# EAGLE design HackadayPin (EAGLE 9.1.3)
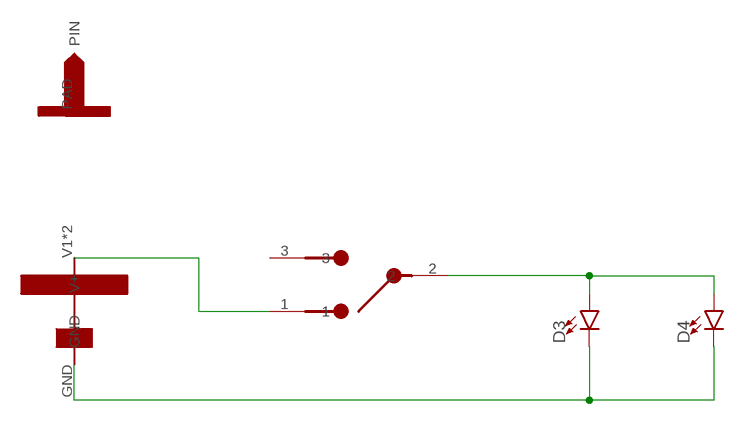
[diagram p0: schematic, sheet 1]

## Parts
D3  LED5MM  [LED_5MM]
D4  LED5MM  [LED_5MM]
U$1  1220BATTERY  [BK-916]
U$2  ALPSSLIDESW  [SWITCH-SSSS810701]
U$3  LAPELPIN  [LAPELPIN]

## Nets
GND1: D3.K(C) D4.K(C) U$1.GND
VBATT: U$1.V1(V+) U$1.V2(V+) U$2.1
VCC1: D3.A D4.A U$2.2
Unconnected: U$2.3 U$3.PAD(PIN)

## Library data of the parts
D3 D4 = SparkFun-LED:LED: LED (Generic) Standard schematic elements and footprints for 5mm, 3mm, 1206, and 0603 sized LEDs. Generic LEDs with no color specified.
U$1 = TindieBadge:1220BATTERY
U$2 = TindieBadge:ALPSSLIDESW
U$3 = TindieBadge:LAPELPIN

## Board
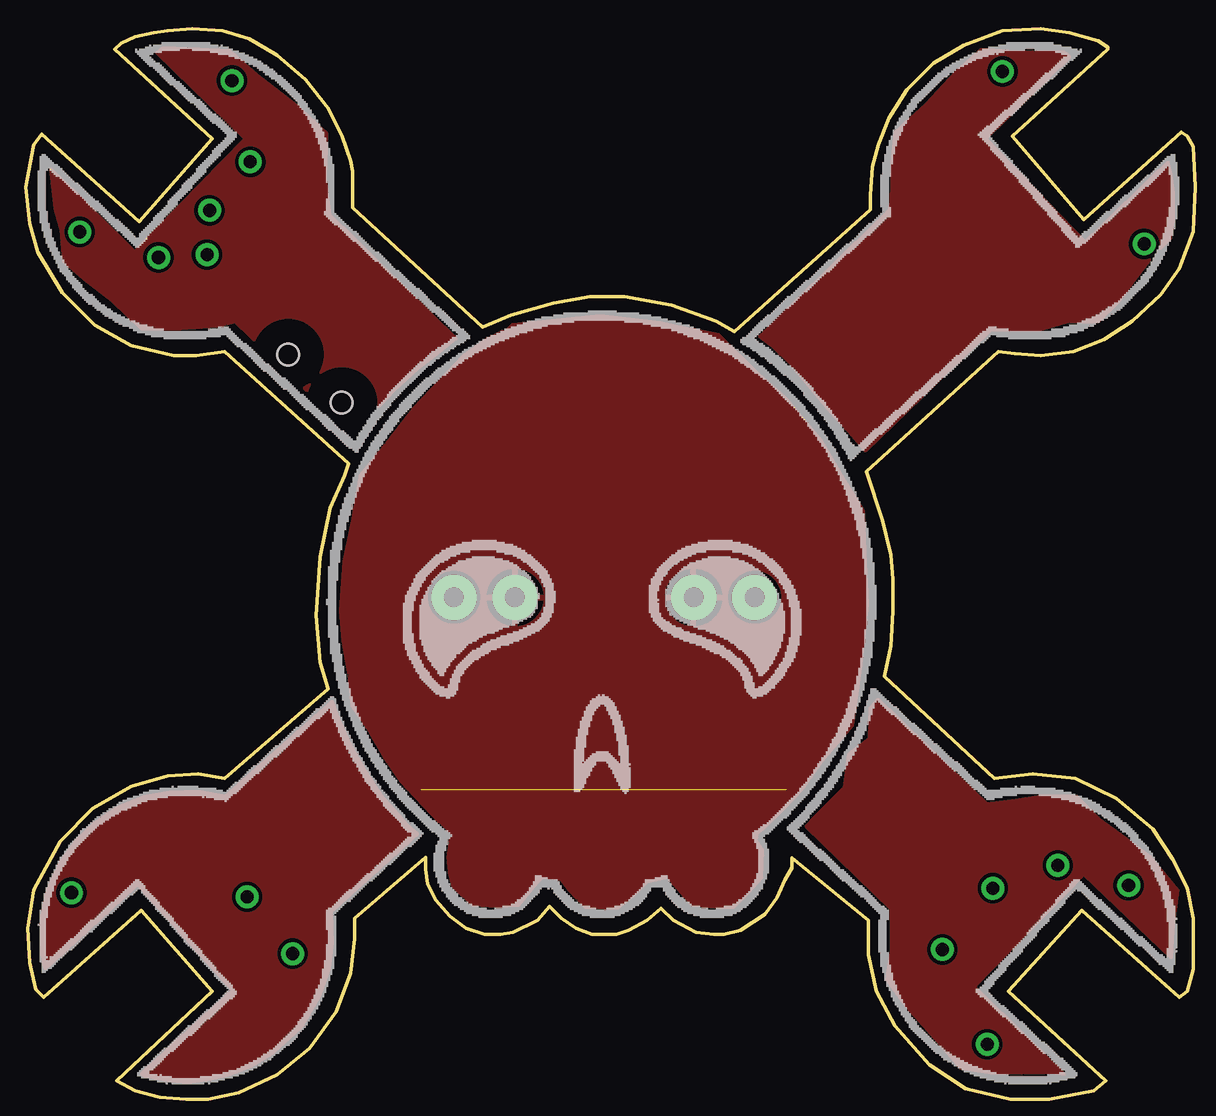
[diagram p1: board, top side]
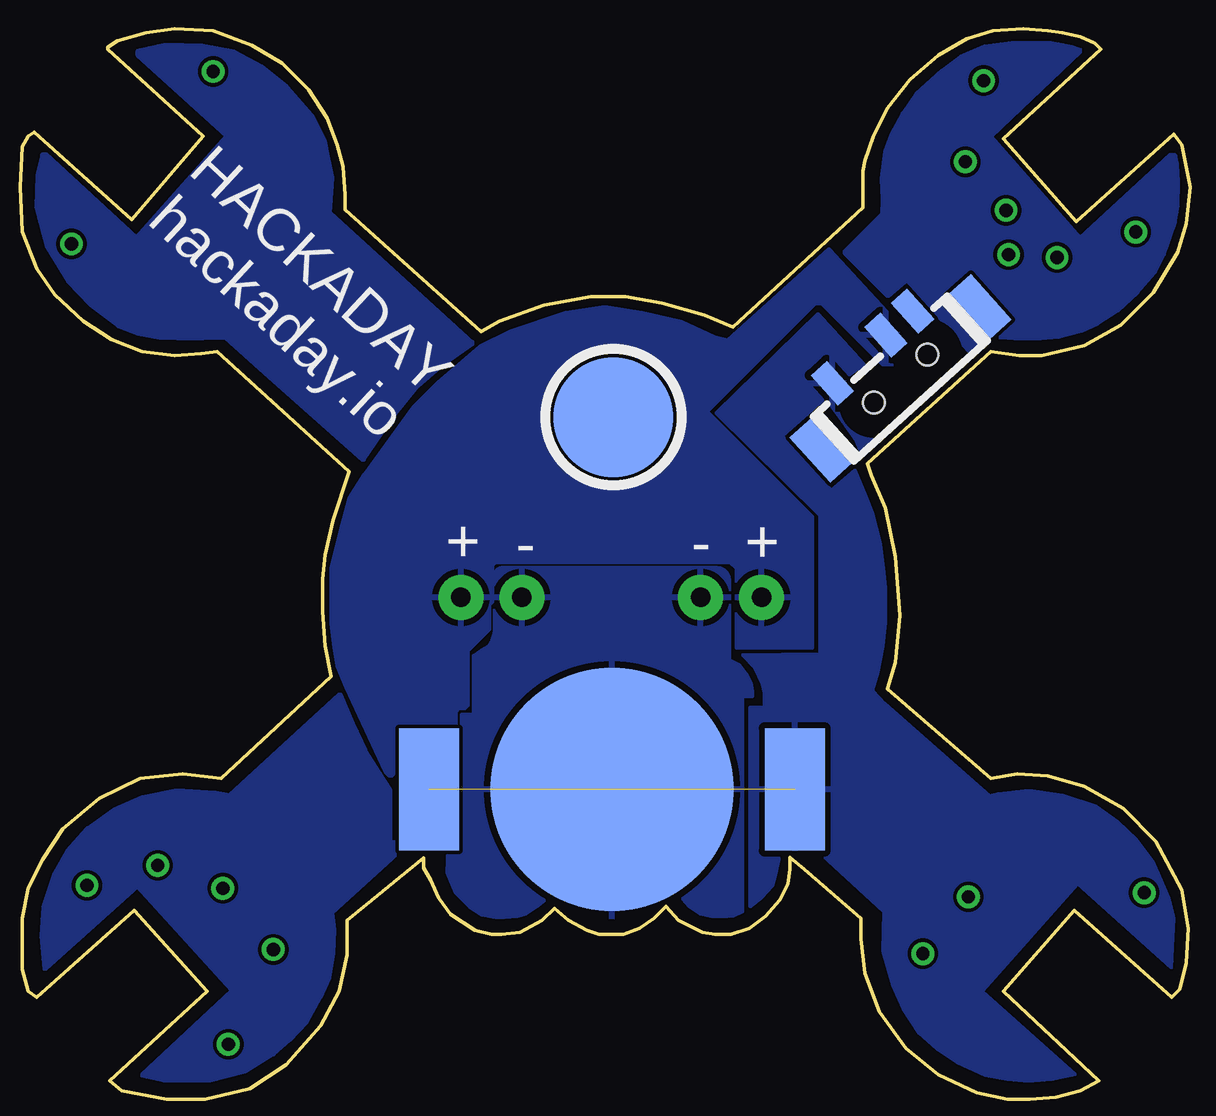
[diagram p2: board, bottom side, seen from below]

No outline drawn. Coordinates in mm, seen from the top.
Copper layers (1*16): Top 0.035mm / dielectric 1.5mm / Bottom 0.035mm
Design rules "default": minimum track width 6mil, minimum drill 0.35mm, track to track 6mil, track to pad 6mil, pad to pad 6mil, via to via 6mil, smd to smd 6mil, copper to edge 40mil, drill to drill 6mil, minimum pad ring 10mil, minimum via ring 8mil, stop-mask expansion 4mil, vias tented up to drill 0mil, thermal gap 10mil
Milling: 156 lines

### Footprints (pad centres in the part's own frame; a part is rotated, then mirrored left to right if it is on the bottom)
LED_5MM = drill 0.813 pad 1.88: A -1.27,0; K 1.27,0
BK-916 = smd 10.16 x 10.16: GND 0,0 | smd 2.5 x 5.1: V1 -7.62,0; V2 7.62,0
SWITCH-SSSS810701 = smd 0.9 x 1.7: 1 -2.25,1.75; 2 0.75,1.75; 3 2.25,1.75 | smd 1.27 x 2.54: P$1 -4.445,0; P$2 4.445,0 | hole 0.9: -1.5,0; 1.5,0
LAPELPIN = smd 5 x 5: PAD 0,0

### Placement (x,y rotation side)
D3  19.26,21.02 0 top
D4  29.25,21.02 180 top
U$1  24.23,13.02 0 bottom
U$2  12.2,30.15 42 bottom
U$3  24.17,28.53 0 bottom

### Tracks (layer width: path | path; a pad name or v marks a point on that pad's centre or on a via)
GND1
  pour Top: 18.42,31.13 19.3,31.75 20.04,32.12 20.09,32.03 20.42,32.39 24.1,32.76 26.58,32.48 27.31,32.31 29.01,31.97 30.69,30.33 31.83,29.31 33.21,27.65 34.15,26.04 35.06,24.6 35.12,22.89 35.21,20.73 34.93,18.06 34.6,15.68 33.33,14.2 32.48,13.01 31.75,12.22 30.85,11.34 30.63,11.19 30.58,10.88 30.85,10.49 30.82,9.33 30.28,8.74 29.61,8.07 28.71,8.12 27.91,8.2 26.91,9.34 26.55,9.3 26.04,9.17 25.47,8.6 24.8,8.06 24.26,8.09 23.47,8.11 22.78,8.84 22.45,9.26 22.1,9.33 21.66,9.36 21.31,8.95 20.67,8.18 19.82,8.15 18.77,8.2 17.96,8.96 17.82,9.55 17.75,10.19 17.85,10.95 18.04,11.07 17.77,11.31 17.05,11.99 15.77,13.38 15.15,14.28 14.5,15.41 13.75,16.5 13.62,17.81 13.37,19.2 13.28,20.47 13.4,22.5 13.78,24.28 14.1,26.12 15.16,27.41 16.32,28.92
  pour Bottom: 18.77,7.93 19.17,7.74 19.6,7.7 20.05,7.73 20.56,7.82 21.01,8.15 21.4,8.58 21.59,8.76 22.11,8.77 22.39,8.51 22.85,8.06 23.3,7.84 23.88,7.67 24.1,7.67 24.84,7.72 25.36,7.94 25.85,8.34 25.99,8.48 26.75,8.62 27.31,8.17 27.82,7.82 28.16,7.72 28.97,7.66 29.64,7.79 30.16,8.11 30.74,8.71 31.1,9.56 31.07,10.56 31,10.89 30.5,10.89 30.5,16.13 30.09,16.13 29.99,16.13 29.99,16.56 29.99,18.6 29.98,18.6 29.68,18.8 29.35,19 29.24,19.17 29.12,19.59 29.12,20.14 29.12,21.94 arc90 28.8,22.26 28.38,22.26 19.85,22.26 arc90 19.33,21.74 19.32,18.63 19.32,18.41 18.91,18.21 18.65,17.86 18.43,17.46 18.38,17.1 18.38,16.9 18.79,16.9 18.79,7.93
N$1  (via drill 0.55)
  other vias: 2.39,36.25
N$2  (via drill 0.55)
  other vias: 5.67,35.19
N$3  (via drill 0.55)
  other vias: 7.8,37.16
N$4
  pour Top: 1.18,38.89 4.69,35.44 9.29,40.14 5.61,43.73 5.88,43.94 7.37,43.87 8.64,43.81 9.77,42.81 11.42,41.54 12.67,40.38 12.62,38.51 12.74,37.49 12.8,36.98 18.07,31.81 17.96,31.73 17.26,31.16 16.47,30.55 15.47,29.65 14.67,28.79 13.82,27.74 8.88,32.52 8.13,32.33 6.61,32.22 4.96,32.22 3.77,33.38 2.69,34.2 1.72,35.01 1.62,36.35 1.37,37.24
N$5
  pour Top: 30.74,31.9 36.14,37.17 36.23,37.49 36.26,39.14 36.39,40.41 37.69,41.59 38.91,42.9 39.98,43.87 41.66,43.74 43.44,43.74 43.66,43.55 40.15,40.14 44.31,35.82 47.74,39.16 47.87,38.63 47.98,37.87 47.98,36.86 47.85,35.97 47.09,35.24 46.33,34.22 45.69,33.33 44.85,32.52 43.56,32.52 42.42,32.19 41.15,32.19 40.39,32.19 35.14,27.12 34.6,27.76 33.69,28.76 32.88,29.73 32.02,30.78 31.31,31.46 30.72,31.89
N$6
  pour Top: 35.8,16.65 40.2,12.41 41.41,12.57 42.42,12.73 43.95,12.73 44.9,11.77 45.93,11.03 47.01,10.2 48.15,8.8 47.95,7.14 47.88,5.99 44.25,9.47 39.69,4.79 43.42,1.15 42.93,1.22 41.66,1.2 40.39,1.2 39.12,1.39 37.75,2.98 36.85,3.98 36.04,5.07 36.23,6.25 36.23,8.03 32.66,11.47 33.07,11.92 34.26,13.1 34.45,14.5 35.31,15.14 35.34,16.41 35.66,16.76
N$7  (via drill 0.55)
  other vias: 9.5,39.18
N$8  (via drill 0.55)
  other vias: 8.74,42.56
N$9  (via drill 0.55)
  other vias: 7.7,35.31
N$10  (via drill 0.55)
  other vias: 46.11,9.01
N$11  (via drill 0.55)
  other vias: 43.17,9.85
N$12  (via drill 0.55)
  other vias: 40.45,8.9
N$13  (via drill 0.55)
  other vias: 38.35,6.34
N$14  (via drill 0.55)
  other vias: 40.22,2.39
N$15  (via drill 0.55)
  other vias: 46.76,35.76
N$16  (via drill 0.55)
  other vias: 40.85,42.95
N$17  (via drill 0.55)
  other vias: 2.05,8.71
N$18  (via drill 0.55)
  other vias: 9.37,8.54
N$19  (via drill 0.55)
  other vias: 11.27,6.17
N$20
  pour Bottom: 32.72,10.76 35.92,7.87 35.83,7.15 35.87,6.18 36.05,5.19 36.42,4.35 36.97,3.34 37.68,2.59 38.35,1.99 39.52,1.27 41.06,0.88 42.88,0.89 43.82,1.11 40.03,4.65 44,8.99 47.86,5.54 47.97,6.92 47.89,8.11 47.44,9.51 46.91,10.44 46.09,11.37 44.97,12.16 43.79,12.69 42.36,12.98 40.77,12.87 40.17,12.76 35.57,16.98 35.06,15.75 34.53,14.64 33.97,13.72 33.5,13.01 33.49,10.82 32.61,10.84 32.71,10.77 32.74,10.79
N$21
  pour Bottom: 14.53,35.4 12.72,33.6 12.02,34.2 11.94,34.27 9.23,31.17 8.59,31.62 8.06,31.89 7.45,31.85 6.56,31.84 5.62,31.91 4.66,32.16 3.99,32.48 3.17,33.01 2.35,33.75 1.62,34.59 1.25,35.33 0.79,36.65 0.67,37.35 0.65,38.33 0.69,39.06 0.76,39.43 0.91,39.47 4.7,35.98 8.46,40.24 4.7,43.81 5.05,43.93 5.94,44.1 7.4,44.11 8.69,43.96 9.7,43.51 10.45,42.96 11.55,41.98 12.09,41.19 12.55,40.3 12.83,39.58 12.98,38.47 12.93,37.62 12.97,36.98 14.53,35.42
N$22
  pour Bottom: 30.27,31.8 35.99,37.04 35.9,38.52 36.07,39.28 36.21,40.05 36.74,41.1 37.79,42.29 38.84,43.14 39.99,43.75 41.33,44 42.82,44.03 44.01,43.77 44,43.64 40.28,40.28 44.06,35.99 47.82,39.48 47.96,39.46 48.16,38.6 48.22,37.29 47.77,35.64 46.88,34.19 45.96,33.23 44.79,32.35 43.97,32.05 43.08,31.87 41.66,31.83 40.81,31.86 40.32,31.87 38.5,30.23 34.6,26.77 33.37,28.57 32.32,29.85 31.41,30.65 30.03,31.62 30.24,31.79
NS69
  pour Top: 8.45,12.72 12.92,16.69 13.15,16.01 13.64,14.93 14.3,13.76 14.93,12.78 15.68,11.95 16.04,11.55 16.48,11.16 12.86,7.9 12.92,6.61 12.79,5.54 12.39,4.44 11.57,3.06 10.49,2.08 9.52,1.48 8.6,1.12 7.67,0.91 6.92,0.81 6.15,0.87 5.11,1.07 4.95,1.16 8.76,4.65 4.81,9.06 0.95,5.54 0.82,6.13 0.79,7.55 1.04,8.78 1.66,10.1 2.27,10.91 3,11.59 3.93,12.24 5.05,12.71 6.14,12.89 7.3,12.93 8.43,12.72
VBATT  (1 unrouted)
  pour Bottom: 12.85,16.58 13.38,17.15 13.15,17.91 12.94,18.99 12.83,19.95 12.83,21.43 12.92,22.25 13.05,23.25 13.38,24.54 13.64,25.23 14.11,26.34 15.08,25.49 17.12,27.74 15.34,29.32 14.75,28.55 14.04,27.54 13.89,27.19 12,28.86 15.65,32.84 19.9,28.71 15.56,24.43 15.57,18.66 18.79,18.63 18.26,18.08 17.95,17.42 17.88,17.04 17.88,16.84 17.88,16.43 18.47,16.43 18.47,8.14 18.44,8.14 18.01,8.51 17.53,9 17.4,9.47 17.28,10.11 17.37,10.52 15.73,10.52 12.89,7.9 12.93,6.3 12.53,4.84 12.08,3.87 11.42,2.84 10.67,2.18 9.85,1.65 8.66,1.11 7.75,0.92 6.86,0.86 5.92,0.92 4.92,1.14 8.78,4.6 4.81,9.07 0.92,5.57 0.87,6.46 0.82,7.64 1.03,8.48 1.68,10.01 2.37,10.93 3.17,11.68 4.04,12.32 5.44,12.77 6.84,12.98 8.12,12.84 8.48,12.75 12.85,16.6
VCC1
  pour Bottom: 11.56,31.62 12.45,30.73 12.95,30.73 15.49,33.27 15.75,33.27 20.26,28.77 15.88,24.38 15.88,18.92 19.05,18.92 19.05,22.23 19.3,22.48 29.08,22.48 29.21,22.35 29.21,20.83 29.34,20.7 29.34,19.68 30.23,18.8 30.23,16.51 30.35,16.38 30.61,16.38 30.73,16.26 30.73,15.75 33.27,15.75 33.27,13.72 33.4,13.59 33.53,13.59 33.66,13.72 35.31,17.27 35.69,18.16 35.81,18.92 35.94,19.94 35.94,22.23 35.56,23.75 35.18,25.15 34.54,26.16 32.51,28.96 31.5,29.97 29.72,31.5 28.45,32.13 26.16,32.89 24.51,33.15 22.99,32.89 21.34,32.51 19.94,31.88 19.42,31.75 15.18,35.55

### Text on the board
bPlace: HACKADAY / hackaday.io | + | - | - | +